# Altium schematic sheet isolated_NO_contacts.SchDoc: foxBMS BMS-Extension
size A3; DocumentNumber: 13; SheetNumber: 13; SheetTotal: 14; Author: Fraunhofer IISB foxBMS Team; REL-DATE: 2017-05-16; VERSION: 1.0.2; GateName_1: G$1; SymbolName_1: FRAME_B_L; LibraryName: foxBMS_BMS-Master_V1.00_A; DeviceSetName: FRAME_B_L; GateName_2: G$2; SymbolName_2: DOCFIELD; SheetDescription: Isolated Normally Open Contacts
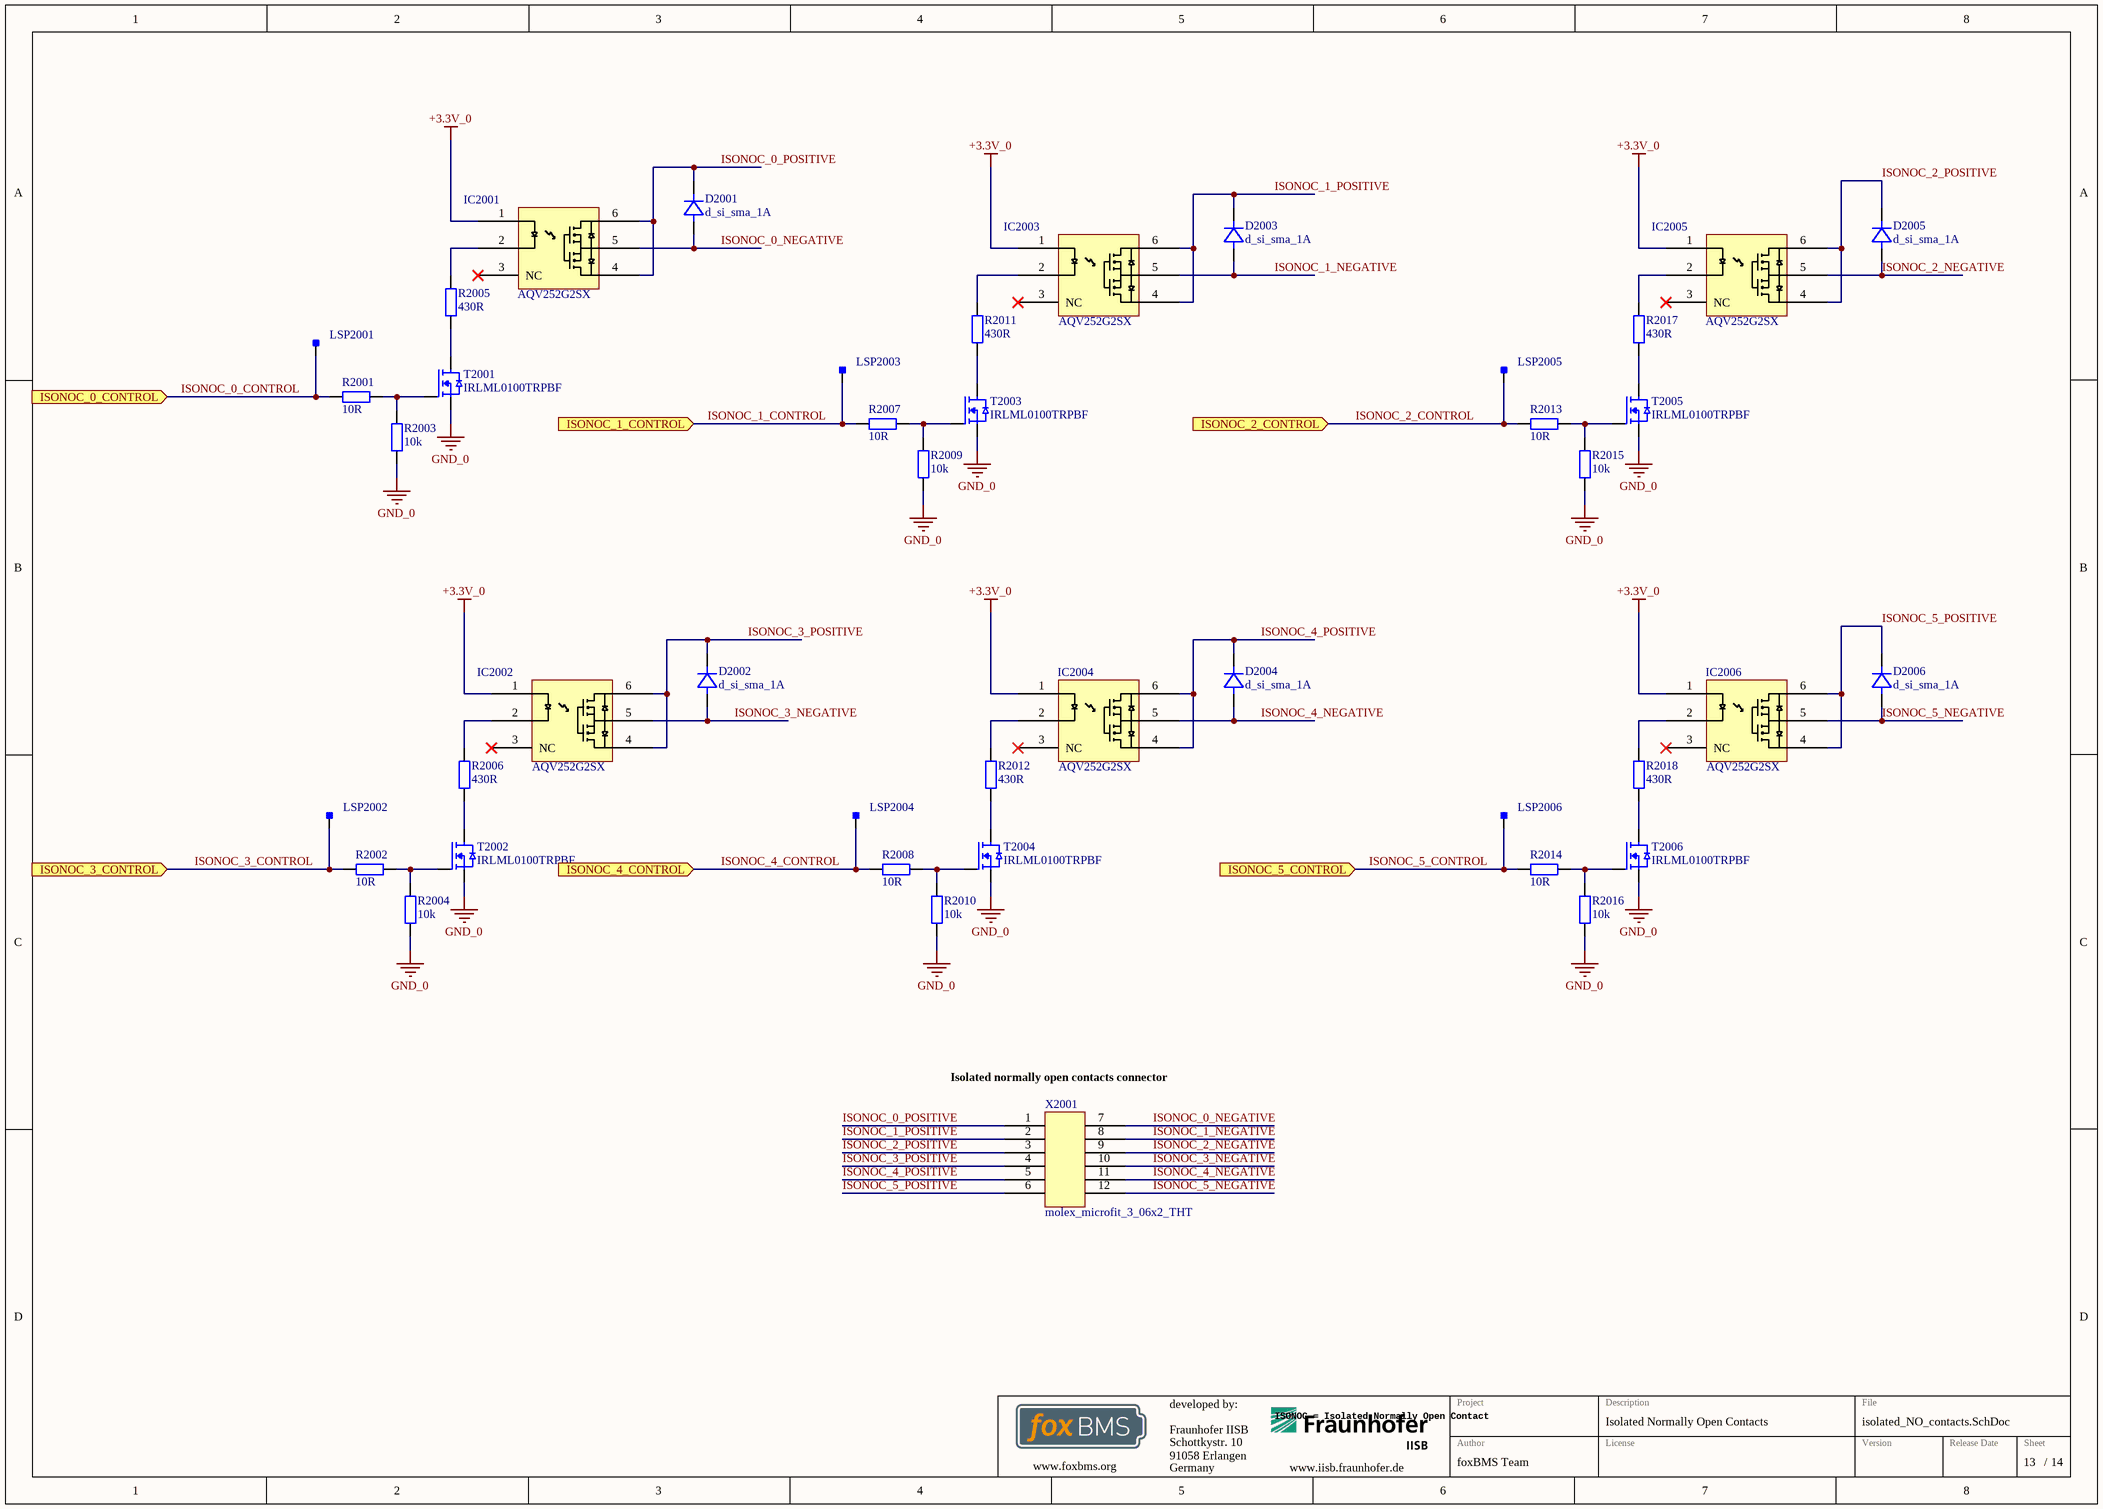
[diagram p0: isolated_NO_contacts.SchDoc]

## Parts
D2001  d_si_sma_1A  [DIOM4326X24N]
D2002  d_si_sma_1A  [DIOM4326X24N]
D2003  d_si_sma_1A  [DIOM4326X24N]
D2004  d_si_sma_1A  [DIOM4326X24N]
D2005  d_si_sma_1A  [DIOM4326X24N]
D2006  d_si_sma_1A  [DIOM4326X24N]
IC2001  AQV252G2SX  [SOP254P680X220-6N]
IC2002  AQV252G2SX  [SOP254P680X220-6N]
IC2003  AQV252G2SX  [SOP254P680X220-6N]
IC2004  AQV252G2SX  [SOP254P680X220-6N]
IC2005  AQV252G2SX  [SOP254P680X220-6N]
IC2006  AQV252G2SX  [SOP254P680X220-6N]
LSP2001  Testpoint_Square  [Testpoint_S1]  (value not drawn)  (no BOM)
LSP2002  Testpoint_Square  [Testpoint_S1]  (value not drawn)  (no BOM)
LSP2003  Testpoint_Square  [Testpoint_S1]  (value not drawn)  (no BOM)
LSP2004  Testpoint_Square  [Testpoint_S1]  (value not drawn)  (no BOM)
LSP2005  Testpoint_Square  [Testpoint_S1]  (value not drawn)  (no BOM)
LSP2006  Testpoint_Square  [Testpoint_S1]  (value not drawn)  (no BOM)
R2001  10R  [RESC1608X05N]
R2002  10R  [RESC1608X05N]
R2003  10k  [RESC1608X05N]
R2004  10k  [RESC1608X05N]
R2005  430R  [RESC1608X05N]
R2006  430R  [RESC1608X05N]
R2007  10R  [RESC1608X05N]
R2008  10R  [RESC1608X05N]
R2009  10k  [RESC1608X05N]
R2010  10k  [RESC1608X05N]
R2011  430R  [RESC1608X05N]
R2012  430R  [RESC1608X05N]
R2013  10R  [RESC1608X05N]
R2014  10R  [RESC1608X05N]
R2015  10k  [RESC1608X05N]
R2016  10k  [RESC1608X05N]
R2017  430R  [RESC1608X05N]
R2018  430R  [RESC1608X05N]
T2001  IRLML0100TRPBF  [SOT95P237X110-3N]
T2002  IRLML0100TRPBF  [SOT95P237X110-3N]
T2003  IRLML0100TRPBF  [SOT95P237X110-3N]
T2004  IRLML0100TRPBF  [SOT95P237X110-3N]
T2005  IRLML0100TRPBF  [SOT95P237X110-3N]
T2006  IRLML0100TRPBF  [SOT95P237X110-3N]
X2001  molex_microfit_3_06x2_THT  [MOLEX_MICROFIT_06x2_THT]

## Ports
ISONOC_0_CONTROL (in), ISONOC_1_CONTROL (in), ISONOC_2_CONTROL (in), ISONOC_3_CONTROL (in), ISONOC_4_CONTROL (in), ISONOC_5_CONTROL (in)

## Nets
+3.3V_0: IC2001.1 IC2002.1 IC2003.1 IC2004.1 IC2005.1 IC2006.1
GND_0: R2003.1 R2004.1 R2009.1 R2010.1 R2015.1 R2016.1 T2001.S T2002.S T2003.S T2004.S T2005.S T2006.S
ISONOC_0_CONTROL: LSP2001.1 R2001.2 ; port ISONOC_0_CONTROL
ISONOC_0_NEGATIVE: D2001.2(A) IC2001.5 X2001.7
ISONOC_0_POSITIVE: D2001.1(K) IC2001.4 IC2001.6 X2001.1
ISONOC_1_CONTROL: LSP2003.1 R2007.2 ; port ISONOC_1_CONTROL
ISONOC_1_NEGATIVE: D2003.2(A) IC2003.5 X2001.8
ISONOC_1_POSITIVE: D2003.1(K) IC2003.4 IC2003.6 X2001.2
ISONOC_2_CONTROL: LSP2005.1 R2013.2 ; port ISONOC_2_CONTROL
ISONOC_2_NEGATIVE: D2005.2(A) IC2005.5 X2001.9
ISONOC_2_POSITIVE: D2005.1(K) IC2005.4 IC2005.6 X2001.3
ISONOC_3_CONTROL: LSP2002.1 R2002.2 ; port ISONOC_3_CONTROL
ISONOC_3_NEGATIVE: D2002.2(A) IC2002.5 X2001.10
ISONOC_3_POSITIVE: D2002.1(K) IC2002.4 IC2002.6 X2001.4
ISONOC_4_CONTROL: LSP2004.1 R2008.2 ; port ISONOC_4_CONTROL
ISONOC_4_NEGATIVE: D2004.2(A) IC2004.5 X2001.11
ISONOC_4_POSITIVE: D2004.1(K) IC2004.4 IC2004.6 X2001.5
ISONOC_5_CONTROL: LSP2006.1 R2014.2 ; port ISONOC_5_CONTROL
ISONOC_5_NEGATIVE: D2006.2(A) IC2006.5 X2001.12
ISONOC_5_POSITIVE: D2006.1(K) IC2006.4 IC2006.6 X2001.6
NetIC2001_2: IC2001.2 R2005.2
NetIC2002_2: IC2002.2 R2006.2
NetIC2003_2: IC2003.2 R2011.2
NetIC2004_2: IC2004.2 R2012.2
NetIC2005_2: IC2005.2 R2017.2
NetIC2006_2: IC2006.2 R2018.2
NetR2001_1: R2001.1 R2003.2 T2001.G
NetR2002_1: R2002.1 R2004.2 T2002.G
NetR2005_1: R2005.1 T2001.D
NetR2006_1: R2006.1 T2002.D
NetR2007_1: R2007.1 R2009.2 T2003.G
NetR2008_1: R2008.1 R2010.2 T2004.G
NetR2011_1: R2011.1 T2003.D
NetR2012_1: R2012.1 T2004.D
NetR2013_1: R2013.1 R2015.2 T2005.G
NetR2014_1: R2014.1 R2016.2 T2006.G
NetR2017_1: R2017.1 T2005.D
NetR2018_1: R2018.1 T2006.D

Not connected (* = marked no-connect by the designer): IC2001 3(NC)*; IC2002 3(NC)*; IC2003 3(NC)*; IC2004 3(NC)*; IC2005 3(NC)*; IC2006 3(NC)*

## Notes on the sheet
- (near X2001) Isolated normally open contacts connector
- ISONOC = Isolated Normally Open Contact
- Fraunhofer IISB
- Schottkystr. 10
- developed by:
- 91058 Erlangen
- Germany
- Author
- Project
- License
- Description
- File
- Version
- Release Date
- Sheet
- www.foxbms.org
- www.iisb.fraunhofer.de
- foxBMS Team
- /

## Library data of the parts
D2001-D2006 = d_si_sma_1A: Standard Recovery Diode, 100 V, 1 A, Single, 1 V, 2 µs, 30 A; Part Name: GF1B; Manufacturer: ON Semiconductor; Breakdown Voltage: 100V; Continuous Forward Current: 1A; Part Number: d_si_sma_1A; Operating Temperature: -65°C - +175°C; ComponentLink1Description: Datasheet; ComponentLink1URL: http://www.farnell.com/datasheets/2303965.pdf; Supplier 1: Farnell; Supplier Part Number 1: 1467477
IC2001-IC2006 = AQV252G2SX: PhotoMOS Relay; Manufacturer: Panasonic; Part Number: AQV252G2SX; Part Name: AQV252G2SX; Operating Temperature: -40°C - +85°C; Supplier 1: Digikey; Supplier Part Number 1: 255-3594-1-ND; Supplier 2: Farnell; Supplier Part Number 2: 2302216
LSP2001-LSP2006 = Testpoint_Square: Testpoint, square; Part Number: Testpoint_Square
R2001 R2002 R2007 R2008 R2013 R2014 = gen_R_10R_0603: SMD Resistor 10R 0603; Tolerance: 1%; Power: 0.1W; Case EIA: 0603; Case Metric: 1608; Maximum Working Voltage: 75V; PnP Package: R_0603; Part Number: gen_R_10R_0603; Operating Temperature: -55°C - +155°C; Resistance: 10R; Series: E24, E96; PnP Value: 10R; Supplier 1: Farnell; Supplier Part Number 1: 2073361
R2003 R2004 R2009 R2010 R2015 R2016 = gen_R_10k_0603: SMD Resistor 10k 0603; Tolerance: 1%; Power: 0.1W; Case EIA: 0603; Case Metric: 1608; Maximum Working Voltage: 75V; PnP Package: R_0603; Part Number: gen_R_10k_0603; Operating Temperature: -55°C - +155°C; Resistance: 10k; Series: E24, E96; PnP Value: 10k; Supplier 1: Farnell; Supplier Part Number 1: 2073349
R2005 R2006 R2011 R2012 R2017 R2018 = gen_R_430R_0603: SMD Resistor 430R 0603; Tolerance: 1%; Power: 0.1W; Case EIA: 0603; Case Metric: 1608; Maximum Working Voltage: 75V; PnP Package: R_0603; Part Number: gen_R_430R_0603; Operating Temperature: -55°C - +155°C; Resistance: 430R; Series: E24; PnP Value: 430R; Supplier 1: Farnell; Supplier Part Number 1: 2074259
T2001-T2006 = IRLML0100TRPBF: MOSFET-Transistor, n-Kanal, 1.6 A, 100 V, 0.178 ohm, 10 V, 2.5 V; Manufacturer: Infineon; Maximum Drain-Source Voltage: 100V; Maximum Continous Drain Current (25°C): 1.6A; R_DS(on): 190m; Total Gate Charge: 2.5nC; Part Number: IRLML0100TRPBF; Part Name: NMOS; Operating Temperature: -55°C - +150°C; ComponentLink1Description: Datasheet URL; ComponentLink1URL: http://www.farnell.com/datasheets/491501.pdf; Supplier 1: Farnell; Supplier Part Number 1: 1783928
X2001 = molex_microfit_3_06x2_THT: Micro-Fit 3.0 Right Angle Header, 3.00mm Pitch, Dual Row, 12 Circuits, with Snap-in Plastic Peg PCB Lock, Tin, Glow Wire Capable, Black, 43045-1200; Manufacturer: Molex; Circuits: 12; Rated Voltage: 600V; Rated Current: 8.5A; Part Number: molex_microfit_3_06x2_THT; Part Name: MicroFit; Operating Temperature: -40°C - +105°C; Supplier 1: Farnell; Supplier Part Number 1: 9732977